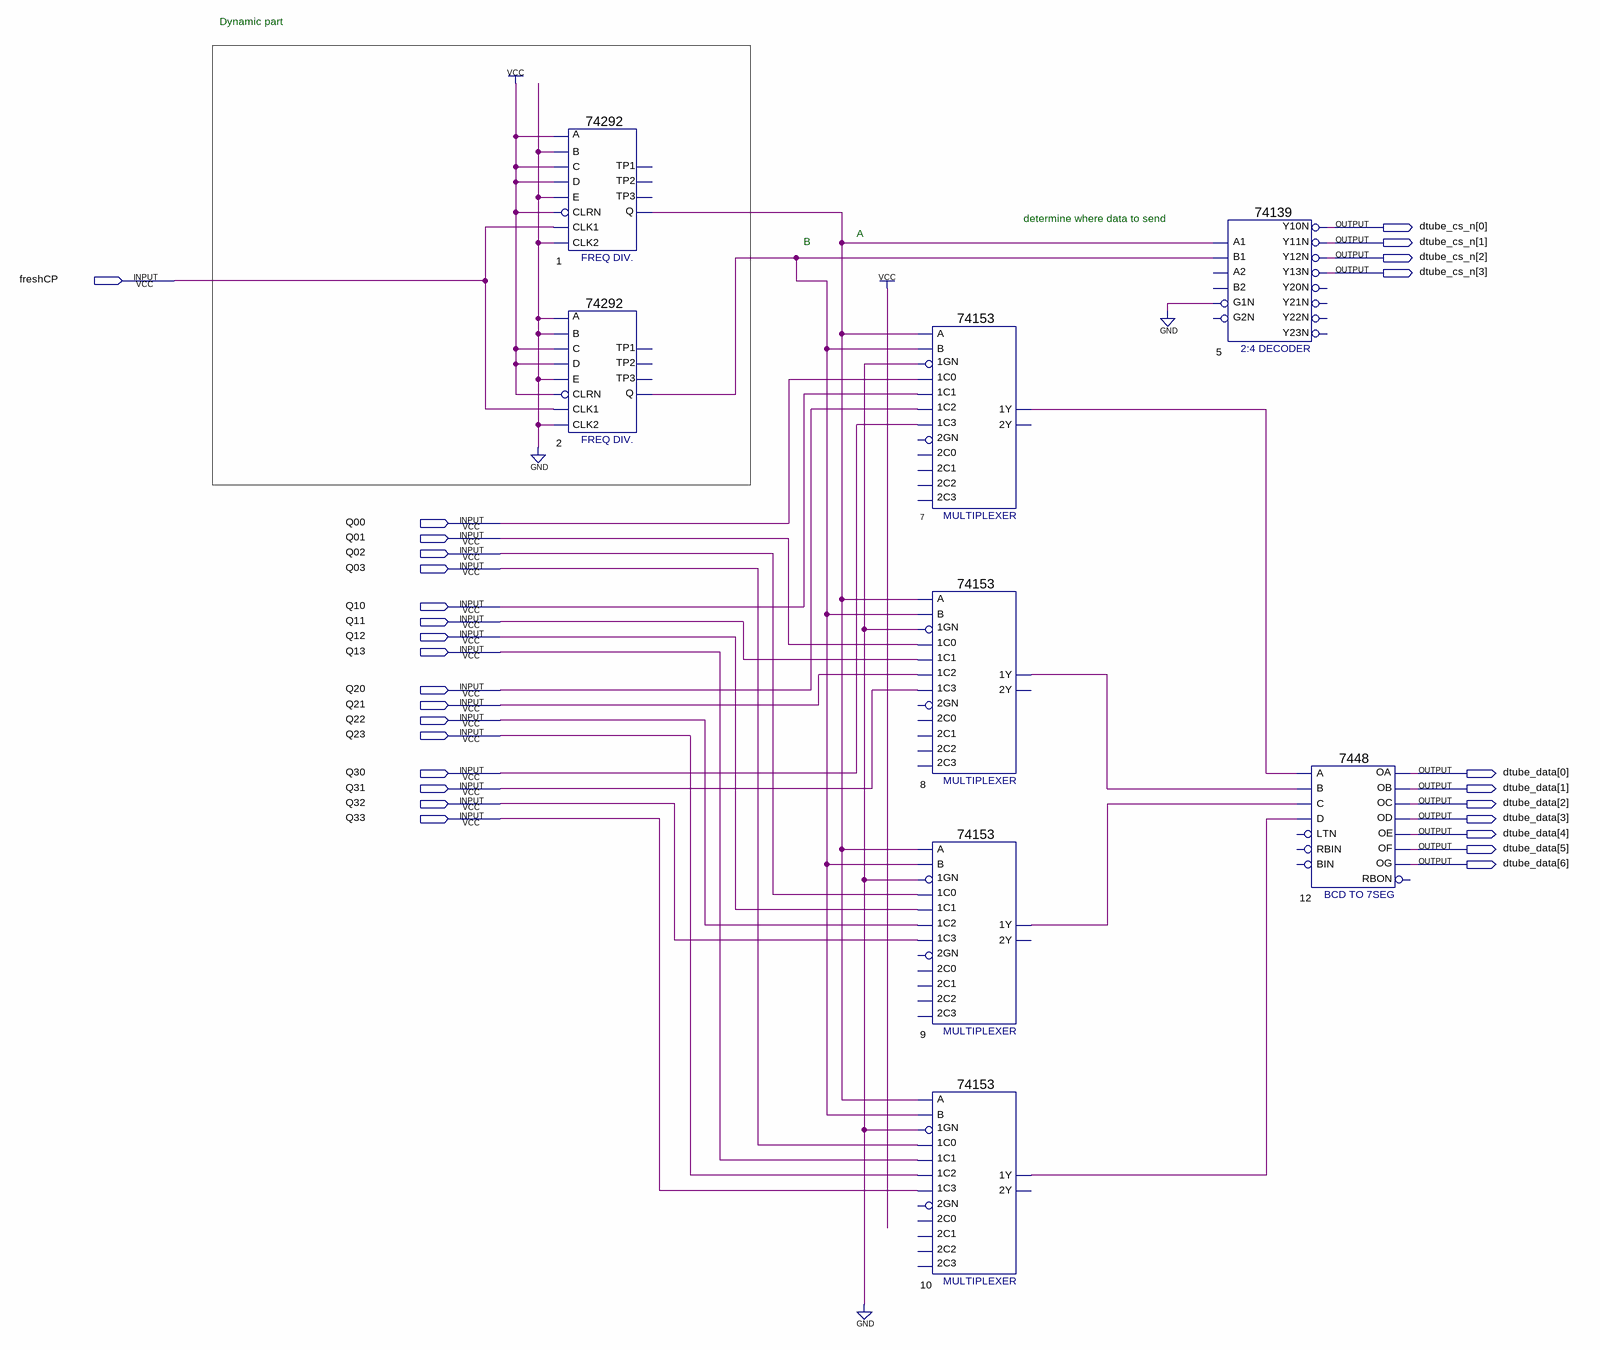
[diagram p0: schematic sheet]
// Quartus schematic display.bdf as structural Verilog: 8 symbols, 28 pins
module display (
  input  freshCP,
  input  Q00,
  input  Q01,
  input  Q02,
  input  Q03,
  input  Q10,
  input  Q11,
  input  Q12,
  input  Q13,
  input  Q20,
  input  Q21,
  input  Q22,
  input  Q23,
  input  Q30,
  input  Q31,
  input  Q32,
  input  Q33,
  output [3:0] dtube_cs_n,
  output [6:0] dtube_data
);

  wire n1_q, n2_q, n7_1y, n8_1y, n9_1y, n10_1y;

  \74292  u_1 (
    .A(1'b1), .D(1'b1), .C(1'b1), .B(1'b0), .CLK1(freshCP), .CLRN(1'b1), .E(1'b0), .CLK2(1'b0), .Q(n1_q));  // open: TP2, TP1, TP3
  \74292  u_2 (
    .A(1'b0), .D(1'b1), .C(1'b1), .B(1'b0), .CLK1(freshCP), .CLRN(1'b1), .E(1'b0), .CLK2(1'b0), .Q(n2_q));  // open: TP2, TP1, TP3
  \74153  u_7 (
    .\1C1 (Q10), .\1GN (1'b0), .\1C0 (Q00), .\1C2 (Q20), .\1C3 (Q30), .B(n2_q), .A(n1_q), .\1Y (n7_1y));  // open: 2C0, 2GN, 2C2, 2C1, 2C3, 2Y
  \74153  u_8 (
    .\1C1 (Q11), .\1GN (1'b0), .\1C0 (Q01), .\1C2 (Q21), .\1C3 (Q31), .B(n2_q), .A(n1_q), .\1Y (n8_1y));  // open: 2C0, 2GN, 2C2, 2C1, 2C3, 2Y
  \74153  u_9 (
    .\1C1 (Q12), .\1GN (1'b0), .\1C0 (Q02), .\1C2 (Q22), .\1C3 (Q32), .B(n2_q), .A(n1_q), .\1Y (n9_1y));  // open: 2C0, 2GN, 2C2, 2C1, 2C3, 2Y
  \74153  u_10 (
    .\1C1 (Q13), .\1GN (1'b0), .\1C0 (Q03), .\1C2 (Q23), .\1C3 (Q33), .B(n2_q), .A(n1_q), .\1Y (n10_1y));  // open: 2C0, 2GN, 2C2, 2C1, 2C3, 2Y
  \74139  u_5 (
    .A1(n1_q), .B1(n2_q), .G1N(1'b0), .Y10N(dtube_cs_n[0]), .Y13N(dtube_cs_n[3]), .Y12N(dtube_cs_n[2]),
    .Y11N(dtube_cs_n[1]));  // open: A2, B2, G2N, Y20N, Y21N, Y22N, Y23N
  \7448  u_12 (
    .A(n7_1y), .C(n9_1y), .D(n10_1y), .B(n8_1y), .OC(dtube_data[2]), .OE(dtube_data[4]), .OD(dtube_data[3]),
    .OF(dtube_data[5]), .OG(dtube_data[6]), .OB(dtube_data[1]), .OA(dtube_data[0]));  // open: RBIN, BIN, LTN, RBON

  // Notes on the sheet:
  //   Dynamic part
  //   determine where data to send
  //   A
  //   B
endmodule
